# Altium schematic sheet LED_STATUS_INPUT.SchDoc
size A4; SheetNumber: 13; SheetTotal: 14
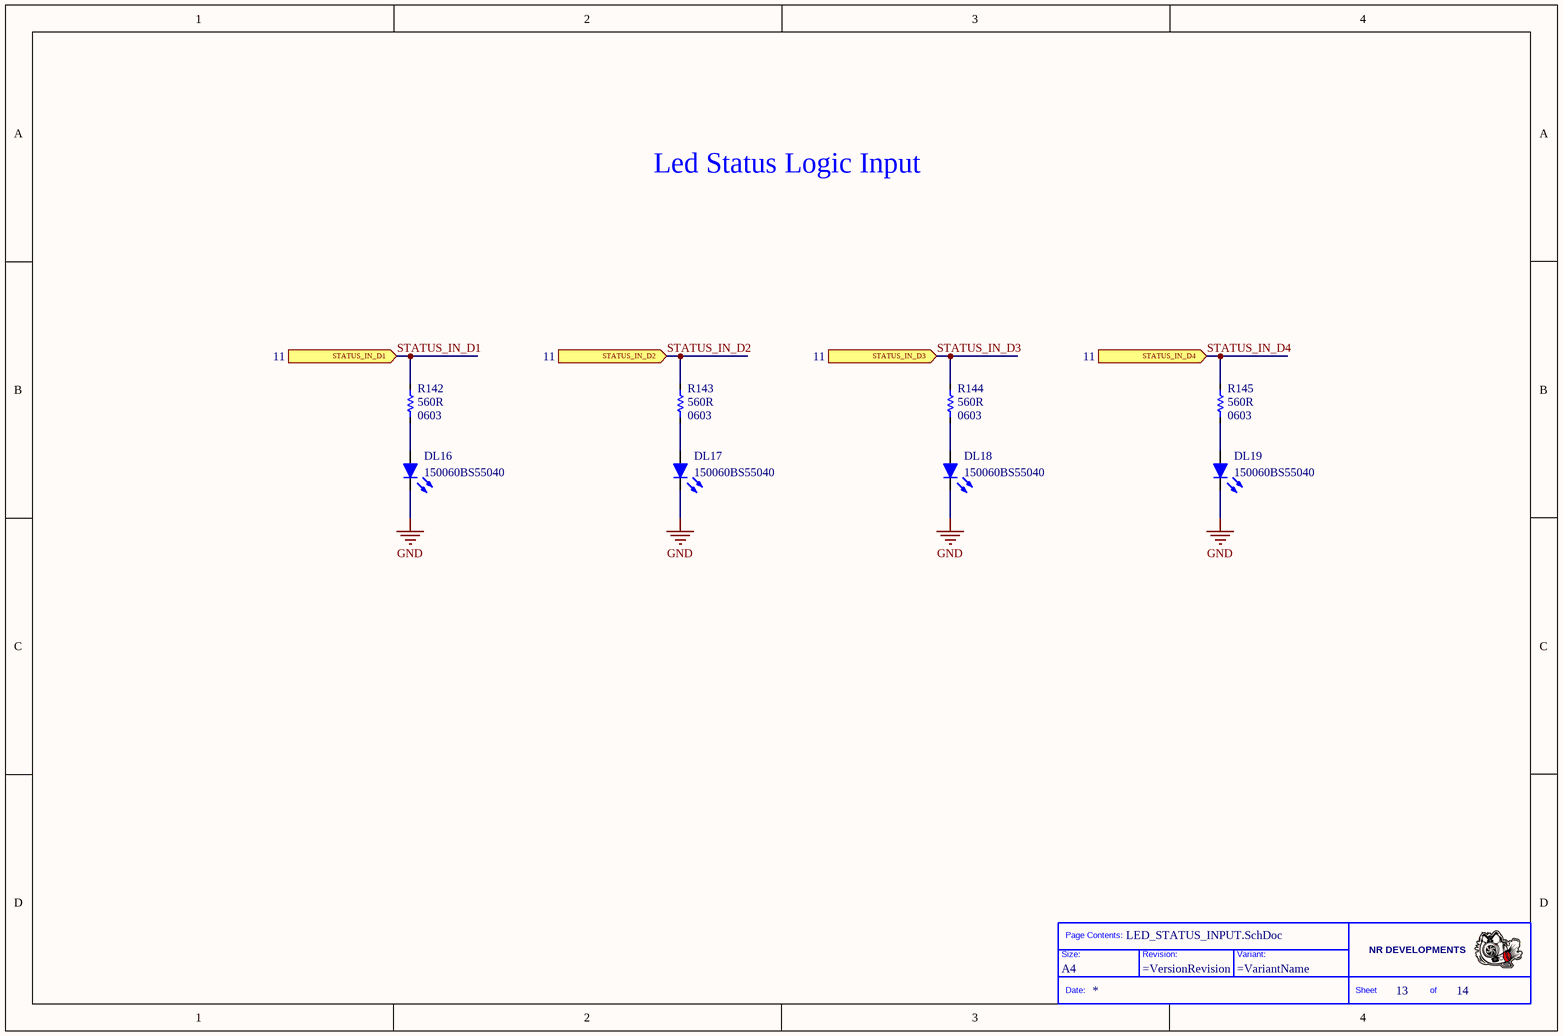
[diagram p0: LED_STATUS_INPUT.SchDoc]

## Parts
*  Size: A4  (hidden comment: Title_Block)  (graphical)
DL16  value 150060BS55040  [LED0603]  (hidden comment: Led_Green)
DL17  value 150060BS55040  [LED0603]  (hidden comment: Led_Green)
DL18  value 150060BS55040  [LED0603]  (hidden comment: Led_Green)
DL19  value 150060BS55040  [LED0603]  (hidden comment: Led_Green)
R142  value 560R  Case: 0603  [RESC1608X06M]  (hidden comment: Res)
R143  value 560R  Case: 0603  [RESC1608X06M]  (hidden comment: Res)
R144  value 560R  Case: 0603  [RESC1608X06M]  (hidden comment: Res)
R145  value 560R  Case: 0603  [RESC1608X06M]  (hidden comment: Res)

## Ports
STATUS_IN_D1 (in, see 11), STATUS_IN_D2 (in, see 11), STATUS_IN_D3 (in, see 11), STATUS_IN_D4 (in, see 11)

## Nets
GND: DL16.C DL17.C DL18.C DL19.C
STATUS_IN_D1: R142.2 ; port STATUS_IN_D1
STATUS_IN_D2: R143.2 ; port STATUS_IN_D2
STATUS_IN_D3: R144.2 ; port STATUS_IN_D3
STATUS_IN_D4: R145.2 ; port STATUS_IN_D4
NetDL16_A: DL16.A R142.1
NetDL17_A: DL17.A R143.1
NetDL18_A: DL18.A R144.1
NetDL19_A: DL19.A R145.1

## Notes on the sheet
- Led Status Logic Input
- (in symbol Title_Block) Page Contents:; NR DEVELOPMENTS; Size:; Revision:; Variant:; Date:; Sheet; of

## Library data of the parts
DL16-DL19 = LED_Blue: Manufacturer: Wurth Elektronik; Case: 0603; PartNumber: 150060BS55040
R142-R145 = Resistor: Manufacturer: Vishay; PartNumber: RC0603FR-07560RL